# EAGLE schematic amplifier (EAGLE 6.1)
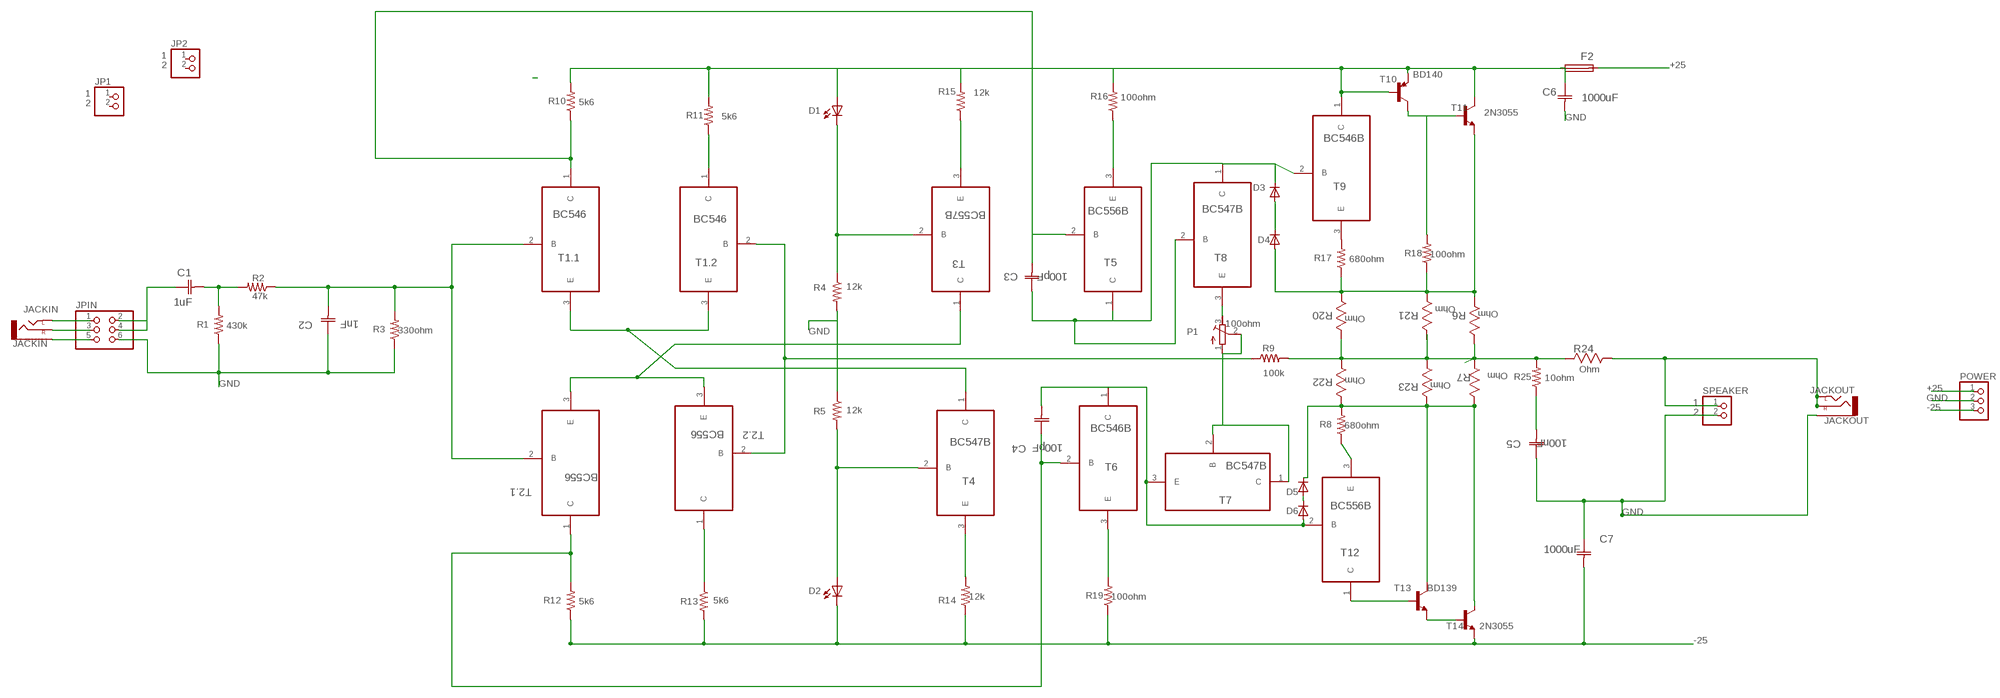
[diagram p0: schematic, sheet 1]

## Parts
C1  1uF  TPSA226K006R0500  [CAPCP3216X180N]
C2  1nF  0805AC102KAT1A  [CAPC2012X130N]
C3  100pF  0805AC102KAT1A  [CAPC2012X130N]
C4  100pF  0805AC102KAT1A  [CAPC2012X130N]
C5  100nF  0805AC102KAT1A  [CAPC2012X130N]
C6  1000uF  0805AC102KAT1A  [CAPC2012X130N]
C7  1000uF  0805AC102KAT1A  [CAPC2012X130N]
D1  LED5MM  [LED5MM]
D2  LED5MM  [LED5MM]
D3  1N4148DO35-10  [DO35-10]
D4  1N4148DO35-10  [DO35-10]
D5  1N4148DO35-10  [DO35-10]
D6  1N4148DO35-10  [DO35-10]
F2  FUSEBLANK_5X20MM  [FUSE_HOLDER_5X20MM]
JACKIN  JACKIN  AUDIO-JACK2.5MM  [STEREOJACK2.5MM_STEREOJACK2.5MM]
JACKOUT  JACKOUT  AUDIO-JACK2.5MM  [STEREOJACK2.5MM_STEREOJACK2.5MM]
JP1  PINHD-1X2  [1X02]
JP2  PINHD-1X2  [1X02]
JPIN  PINHD-2X3/90  [2X03/90]
P1  100ohm  R-TRIMM74X  [RTRIM74X]
POWER  PINHD-1X3/90  [1X03/90]
R1  430k  RESISTORPTH-2W  [AXIAL-0.8]
R2  47k  RESISTORPTH-2W  [AXIAL-0.8]
R3  330ohm  RESISTORPTH-2W  [AXIAL-0.8]
R4  12k  RESISTORPTH-2W  [AXIAL-0.8]
R5  12k  RESISTORPTH-2W  [AXIAL-0.8]
R6  Ohm  CRM0805-FW-R050ELF  [RESC2013X65N]
R7  Ohm  CRM0805-FW-R050ELF  [RESC2013X65N]
R8  680ohm  RESISTORPTH-2W  [AXIAL-0.8]
R9  100k  RESISTORPTH-2W  [AXIAL-0.8]
R10  5k6  RESISTORPTH-2W  [AXIAL-0.8]
R11  5k6  RESISTORPTH-2W  [AXIAL-0.8]
R12  5k6  RESISTORPTH-2W  [AXIAL-0.8]
R13  5k6  RESISTORPTH-2W  [AXIAL-0.8]
R14  12k  RESISTORPTH-2W  [AXIAL-0.8]
R15  12k  RESISTORPTH-2W  [AXIAL-0.8]
R16  100ohm  RESISTORPTH-2W  [AXIAL-0.8]
R17  680ohm  RESISTORPTH-2W  [AXIAL-0.8]
R18  100ohm  RESISTORPTH-2W  [AXIAL-0.8]
R19  100ohm  RESISTORPTH-2W  [AXIAL-0.8]
R20  Ohm  CRM0805-FW-R050ELF  [RESC2013X65N]
R21  Ohm  CRM0805-FW-R050ELF  [RESC2013X65N]
R22  Ohm  CRM0805-FW-R050ELF  [RESC2013X65N]
R23  Ohm  CRM0805-FW-R050ELF  [RESC2013X65N]
R24  Ohm  CRM0805-FW-R050ELF  [RESC2013X65N]
R25  10ohm  RESISTORPTH-2W  [AXIAL-0.8]
SPEAKER  PINHD-1X2/90  [1X02/90]
T1.1  BC546  BC546B  [TO127P254X732-3]
T1.2  BC546  BC546B  [TO127P254X732-3]
T2.1  BC556  BC556B  [TO127P254X732-3]
T2.2  BC556  BC556B  [TO127P254X732-3]
T3  BC557B  [TO127P254X732-3]
T4  BC547B  [TO127P254X732-3]
T5  BC556B  [TO127P254X732-3]
T6  BC546B  [TO127P254X732-3]
T7  BC547B  [TO127P254X732-3]
T8  BC547B  [TO127P254X732-3]
T9  BC546B  [TO127P254X732-3]
T10  BD140  [TO126]
T11  2N3055  [TO3]
T12  BC556B  [TO127P254X732-3]
T13  BD139  [TO126]
T14  2N3055  [TO3]

## Nets
+25: F2.2 POWER.1
-25: C7.2(C2) D2.K(C) POWER.3 R12.P$1 R13.P$2 R14.P$1 R19.P$1 T14.E
GND: C2.1(C1) C5.1(C1) C6.2(C2) C7.1(C1) JACKOUT.RING1(SLEEVE) JPIN.6 POWER.2 R1.P$1 R3.P$1 R4.P$2 R5.P$1 SPEAKER.2
N$1: JACKIN.SHIELD(LEFT) JPIN.1
N$2: C1.2(C2) R1.P$2 R2.P$2
N$3: JACKOUT.SHIELD(LEFT) JACKOUT.TIP(RIGHT) R24.1(R1) SPEAKER.1
N$4: C2.2(C2) R2.P$1 R3.P$2 T1.1.2(B) T2.1.2(B)
N$5: P1.3(E) T8.3(E)
N$6: T2.1.3(E) T2.2.3(E) T3.1(C)
N$7: P1.1(A) P1.2(S) R9.P$1 T1.2.2(B) T2.2.2(B) T7.1(C) T7.2(B)
N$8: C3.2(C2) R10.P$1 T1.1.1(C) T5.2(B)
N$9: T1.1.3(E) T1.2.3(E) T4.1(C)
N$10: C4.1(C1) R12.P$2 T2.1.1(C) T6.2(B)
N$12: R11.P$1 T1.2.1(C)
N$13: C5.2(C2) R25.P$1
N$14: D1.K(C) R4.P$1 T3.2(B)
N$15: R13.P$1 T2.2.1(C)
N$17: D2.A R5.P$2 T4.2(B)
N$18: R14.P$2 T4.3(E)
N$19: R15.P$1 T3.3(E)
N$20: R16.P$1 T5.3(E)
N$21: C3.1(C1) D3.C T5.1(C) T8.1(C) T8.2(B) T9.2(B)
N$22: R19.P$2 T6.3(E)
N$23: C4.2(C2) D6.A T6.1(C) T7.3(E) T12.2(B)
N$24: JACKIN.RING1(SLEEVE) JPIN.5
N$25: JACKIN.TIP(RIGHT) JPIN.3
N$26: D5.A D6.C
N$27: R17.P$2 T9.3(E)
N$28: D3.A D4.C
N$29: D4.A R6.2(R2) R17.P$1 R18.P$1 R20.2(R2) R21.2(R2) T11.E
N$30: C6.1(C1) D1.A F2.1 R10.P$2 R11.P$2 R15.P$2 R16.P$2 T9.1(C) T10.1(E) T10.3(B) T11.C T11.C/(C)
N$31: R18.P$2 T10.2(C) T11.B
N$32: R8.P$1 T12.3(E)
N$33: T12.1(C) T13.3(B)
N$34: T13.1(E) T14.B
N$36: R6.1(R1) R7.2(R2) R9.P$2 R20.1(R1) R21.1(R1) R22.2(R2) R23.2(R2) R24.2(R2) R25.P$2
N$37: D5.C R7.1(R1) R8.P$2 R22.1(R1) R23.1(R1) T13.2(C) T14.C T14.C/(C)
N$40: C1.1(C1) JPIN.2 JPIN.4
Unconnected: JP1.1 JP1.2 JP2.1 JP2.2

## Library data of the parts
C1 = AVX_By_element14_Batch_1:TPSA226K006R0500: Tantalum Capacitor , 1206; CAPACITANCETOLERANCE: ±10%; MPN: TPSA226K006R0500; OC_FARNELL: -; OC_NEWARK: 75M9217; SUPPLIER: AVX; VALUE: 22UF; VOLTAGERATING: 6.3V
C2-C7 = AVX_By_element14_Batch_1:0805AC102KAT1A: Capacitor 0805; MPN: 0805AC102KAT1A; OC_FARNELL: 1702669; OC_NEWARK: 18M3468; SUPPLIER: AVX; TOLERANCE: ±10%; VALUE: 1000pF; VOLTAGERATING: 1000V (1kV)
D1 D2 = led:LED: LED OSRAM: - CHIPLED LG R971, LG N971, LY N971, LG Q971, LY Q971, LO R971, LY R971 LH N974, LH R974 LS Q976, LO Q976, LY Q976 LO Q996 - Hyper CHIPLED LW Q18S LB Q993, LB Q99A, LB R99A - SideLED LS A670, LO A670, LY A670, LG A670, LP A670 LB A673, LV A673, LT A673, LW A673 LH A674 LY A675 LS A676, LA A676, LO A676, LY A676, LW A676 LS A679, LY A679, LG A679 - Hyper Micro SIDELED® LS Y876, LA Y876, LO Y876, LY Y876 LT Y87S - SmartLED LW L88C, LW L88S LB L89C, LB L89S, LG L890 LS L89K, LO L89K, LY L89K LS L896, LA L896, LO L896, LY L896 - TOPLED LS T670, LO T670, LY T670, LG T670, LP T670 LSG T670, LSP T670, LSY T670, LOP T670, LYG T670 LG T671, LOG T671, LSG T671 LB T673, LV T673, LT T673, LW T673 LH T674 LS T676, LA T676, LO T676, LY T676, LB T676, LH T676, LSB T676, LW T676 LB T67C, LV T67C, LT T67C, LS T67K, LO T67K, LY T67K, LW E67C LS E67B, LA E67B, LO E67B, LY E67B, LB E67C, LV E67C, LT E67C LW T67C LS T679, LY T679, LG T679 LS T770, LO T770, LY T770, LG T770, LP T770 LB T773, LV T773, LT T773, LW T773 LH T774 LS E675, LA E675, LY E675, LS T675 LS T776, LA T776, LO T776, LY T776, LB T776 LHGB T686 LT T68C, LB T68C - Hyper Mini TOPLED® LB M676 - Mini TOPLED Santana® LG M470 LS M47K, LO M47K, LY M47K Source: http://www.osram.convergy.de LUXEON: - LUMILED® LXK2-PW12-R00, LXK2-PW12-S00, LXK2-PW14-U00, LXK2-PW14-V00 LXK2-PM12-R00, LXK2-PM12-S00, LXK2-PM14-U00 LXK2-PE12-Q00, LXK2-PE12-R00, LXK2-PE12-S00, LXK2-PE14-T00, LXK2-PE14-U00 LXK2-PB12-K00, LXK2-PB12-L00, LXK2-PB12-M00, LXK2-PB14-N00, LXK2-PB14-P00, LXK2-PB14-Q00 LXK2-PR12-L00, LXK2-PR12-M00, LXK2-PR14-Q00, LXK2-PR14-R00 LXK2-PD12-Q00, LXK2-PD12-R00, LXK2-PD12-S00 LXK2-PH12-R00, LXK2-PH12-S00 LXK2-PL12-P00, LXK2-PL12-Q00, LXK2-PL12-R00 Source: www.luxeon.com KINGBRIGHT: KA-3528ASYC Source: www.kingbright.com
D3-D6 = diode:1N4148: DIODE high speed (Philips)
F2 = fuse:FUSE: Fuse; OC_FARNELL: unknown; OC_NEWARK: unknown
JACKIN JACKOUT = SparkFun-Connectors:AUDIO-JACK: 3.5mm Audio Jack Simple 3.5mm common PCB mount audio jack. SKU: PRT-08032
JP1 JP2 = pinhead:PINHD-1X2: PIN HEADER; PINEND: 2; PINSTART: 1
JPIN = pinhead:PINHD-2X3: PIN HEADER
P1 = rcl:R-TRIMM: Trimm resistor
POWER = pinhead:PINHD-1X3: PIN HEADER
R1-R5 R8-R19 R25 = SparkFun-Resistors:RESISTOR: Resistor Basic schematic elements and footprints for 0603, 1206, and PTH resistors.
R6 R7 R20-R24 = Bourns_By_element14_Batch_1:CRM0805-FW-R050ELF: Resistor 0805; MPN: CRM0805-FW-R050ELF; OC_FARNELL: 1865234; OC_NEWARK: 17T4231; SUPPLIER: BOURNS; TOLERANCE: ±1 %; VALUE: 0.05 Ohm; WATTAGE: 0.25 W
SPEAKER = pinhead:PINHD-1X2: PIN HEADER
T1.1 T1.2 T6 T9 = Fairchild_By_element14_Batch_1:BC546B: NPN Epitaxial Silicon Transistor; MPN: BC546B; OC_FARNELL: 1467868; OC_NEWARK: 58K8752; PACKAGE: TO-92; SUPPLIER: Fairchild
T2.1 T2.2 T5 T12 = Fairchild_By_element14_Batch_1:BC556B: PNP Epitaxial Silicon Transistor; MPN: BC556B; OC_FARNELL: 1467881; OC_NEWARK: 58K8759; PACKAGE: TO-92; SUPPLIER: Fairchild
T3 = Fairchild_By_element14_Batch_1:BC557B: PNP Epitaxial Silicon Transistor; MPN: BC557B; OC_FARNELL: 1017678; OC_NEWARK: 58K0100; PACKAGE: TO-92; SUPPLIER: Fairchild
T4 T7 T8 = Fairchild_By_element14_Batch_1:BC547B: NPN Epitaxial Silicon Transistor; MPN: BC547B; OC_FARNELL: 1017673; OC_NEWARK: 67K3328; PACKAGE: TO-92; SUPPLIER: Fairchild
T10 = transistor-pnp:BD140: PNP Transistor
T11 T14 = transistor:2N3055: NPN TRANSISTOR
T13 = transistor:BD139: NPN TRANSISTOR